# EAGLE design NSP2C (EAGLE 8.4.0)
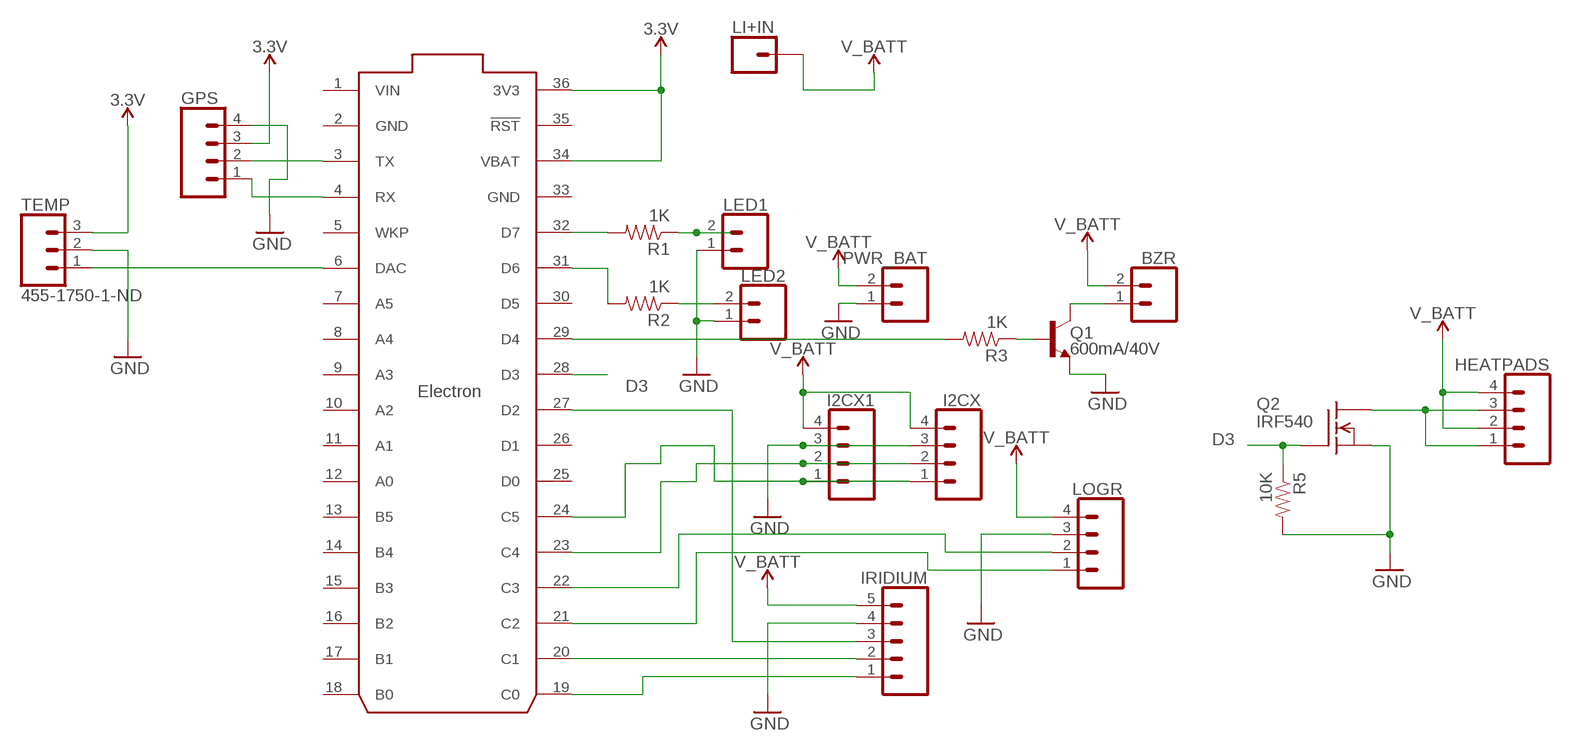
[diagram p0: schematic, sheet 1]

## Parts
BZR  CONN_02  [1X02]
GPS  CONN_04  [1X04]
HEATPADS  CONN_04  [1X04]
I2CX  CONN_04  [1X04]
I2CX1  CONN_04  [1X04]
IRIDIUM  CONN_05  [1X05]
LED1  CONN_02  [1X02]
LED2  CONN_02  [1X02]
LI+IN  CONN_01  [1X01]
LOGR  CONN_04  [1X04]
PWR_BAT  CONN_02  [1X02]
Q1  600mA/40V  TRANS_NPN-P2N2222A  [TO-92]
Q2  IRF540  [TO220]
R1  1K  RESISTORPTH-1/6W  [1/6W-RES]
R2  1K  RESISTORPTH-1/6W  [1/6W-RES]
R3  1K  RESISTORPTH-1/6W  [1/6W-RES]
R5  10K  RESISTORPTH-1/6W  [1/6W-RES]
TEMP  455-1750-1-ND  CONN_03  [1X03]
U$1  ELECTRON_WITH_HEADERS  [ELECTRON]

## Nets
3.3V: GPS.3 TEMP.3 U$1.34(VBAT) U$1.36(3V3)
BASE: Q1.2(B) R3.1
D3: Q2.1(G) R5.1 U$1.28(D3)
GND: GPS.4 I2CX1.3 I2CX.3 IRIDIUM.4 LED1.1 LED2.1 LOGR.3 PWR_BAT.1 Q1.3(E) Q2.3(S) R5.2 TEMP.2
IRWKP: IRIDIUM.3 U$1.27(D2)
N$1: TEMP.1 U$1.6(DAC)
N$3: R1.2 U$1.32(D7)
N$6: R3.2 U$1.29(D4)
N$8: LED1.2 R1.1
N$9: BZR.1 Q1.1(C)
N$11: HEATPADS.1 HEATPADS.3 Q2.2(D)
N$13: R2.2 U$1.31(D6)
N$14: IRIDIUM.2 U$1.20(C1)
N$15: I2CX1.1 I2CX.1 U$1.24(C5)
N$16: LED2.2 R2.1
RX: GPS.1 U$1.4(RX)
SDA: I2CX1.2 I2CX.2 U$1.23(C4)
TX: GPS.2 U$1.3(TX)
UART4_RX: LOGR.1 U$1.21(C2)
UART4_TX: LOGR.2 U$1.22(C3)
UART5_RX: IRIDIUM.1 U$1.19(C0)
V_BATT: BZR.2 HEATPADS.2 HEATPADS.4 I2CX1.4 I2CX.4 IRIDIUM.5 LI+IN.1 LOGR.4 PWR_BAT.2
Unconnected: U$1.5(WKP) U$1.7(A5) U$1.8(A4) U$1.9(A3) U$1.10(A2) U$1.11(A1) U$1.12(A0) U$1.13(B5) U$1.14(B4) U$1.15(B3) U$1.16(B2) U$1.17(B1) U$1.18(B0) U$1.25(D0) U$1.26(D1) U$1.30(D5) U$1.35(!RST)

## Power pins joined to a net without a drawn wire
GND: U$1.2(GND) U$1.33(GND)
VIN: U$1.1(VIN)

## Library data of the parts
BZR LED1 LED2 PWR_BAT = SparkFun-Connectors:CONN_02: Multi connection point. Often used as Generic Header-pin footprint for 0.1 inch spaced/style header connections On any of the 0.1 inch spaced packages, you can populate with these: Break Away Headers - Straight <https://www.sparkfun.com/products/116> (PRT-00116) Break Away Male Headers - Right Angle <https://www.sparkfun.com/products/553> (PRT-00553) Female Headers <https://www.sparkfun.com/products/115> (PRT-00115) Break Away Headers - Machine Pin <https://www.sparkfun.com/products/117> (PRT-00117) Break Away Female Headers - Swiss Machine Pin <https://www.sparkfun.com/products/743> (PRT-00743) For SCREWTERMINALS and SPRING TERMINALS visit here: Screw Terimnals on SparkFun.com <https://www.sparkfun.com/search/results?term=Screw+Terminals> (5mm/3.5mm/2.54mm spacing) This device is also useful as a general connection point to wire up your design to another part of your project. Our various solder wires solder well into these plated through hole pads. Hook-Up Wire - Assortment (Stranded, 22 AWG) <https://www.sparkfun.com/products/11375> (PRT-11375) Hook-Up Wire - Assortment (Solid Core, 22 AWG) <https://www.sparkfun.com/products/11367> (PRT-11367) View the entire wire category on our website here <https://www.sparkfun.com/categories/141> Special notes: Molex polarized connector foot print use with: PRT-08233 with associated crimp pins and housings. 2.54_SCREWTERM for use with PRT-10571. 3.5mm Screw Terminal footprints for PRT-08084 5mm Screw Terminal footprints for use with PRT-08432
GPS HEATPADS I2CX I2CX1 LOGR = SparkFun-Connectors:CONN_04: Multi connection point. Often used as Generic Header-pin footprint for 0.1 inch spaced/style header connections On any of the 0.1 inch spaced packages, you can populate with these: Break Away Headers - Straight <https://www.sparkfun.com/products/116> (PRT-00116) Break Away Male Headers - Right Angle <https://www.sparkfun.com/products/553> (PRT-00553) Female Headers <https://www.sparkfun.com/products/115> (PRT-00115) Break Away Headers - Machine Pin <https://www.sparkfun.com/products/117> (PRT-00117) Break Away Female Headers - Swiss Machine Pin <https://www.sparkfun.com/products/743> (PRT-00743) For SCREWTERMINALS and SPRING TERMINALS visit here: Screw Terimnals on SparkFun.com <https://www.sparkfun.com/search/results?term=Screw+Terminals> (5mm/3.5mm/2.54mm spacing) This device is also useful as a general connection point to wire up your design to another part of your project. Our various solder wires solder well into these plated through hole pads. Hook-Up Wire - Assortment (Stranded, 22 AWG) <https://www.sparkfun.com/products/11375> (PRT-11375) Hook-Up Wire - Assortment (Solid Core, 22 AWG) <https://www.sparkfun.com/products/11367> (PRT-11367) View the entire wire category on our website here <https://www.sparkfun.com/categories/141> Special notes: Molex polarized connector foot print use with SKU : PRT-08231 with associated crimp pins and housings. 1MM SMD Version SKU: PRT-10208; PROD_ID: CONN-09696
IRIDIUM = SparkFun-Connectors:CONN_05: Multi connection point. Often used as Generic Header-pin footprint for 0.1 inch spaced/style header connections On any of the 0.1 inch spaced packages, you can populate with these: Break Away Headers - Straight <https://www.sparkfun.com/products/116> (PRT-00116) Break Away Male Headers - Right Angle <https://www.sparkfun.com/products/553> (PRT-00553) Female Headers <https://www.sparkfun.com/products/115> (PRT-00115) Break Away Headers - Machine Pin <https://www.sparkfun.com/products/117> (PRT-00117) Break Away Female Headers - Swiss Machine Pin <https://www.sparkfun.com/products/743> (PRT-00743) For SCREWTERMINALS and SPRING TERMINALS visit here: Screw Terimnals on SparkFun.com <https://www.sparkfun.com/search/results?term=Screw+Terminals> (5mm/3.5mm/2.54mm spacing) This device is also useful as a general connection point to wire up your design to another part of your project. Our various solder wires solder well into these plated through hole pads. Hook-Up Wire - Assortment (Stranded, 22 AWG) <https://www.sparkfun.com/products/11375> (PRT-11375) Hook-Up Wire - Assortment (Solid Core, 22 AWG) <https://www.sparkfun.com/products/11367> (PRT-11367) View the entire wire category on our website here <https://www.sparkfun.com/categories/141> Special notes: Molex polarized connector foot print use with SKU : PRT-08231 with associated crimp pins and housings. 1MM SMD Version SKU: PRT-10208
LI+IN = SparkFun-Connectors:CONN_01: Single connection point. Often used as Generic Header-pin footprint for 0.1 inch spaced/style header connections On any of the 0.1 inch spaced packages, you can populate with these: Break Away Headers - Straight <https://www.sparkfun.com/products/116> (PRT-00116) Break Away Male Headers - Right Angle <https://www.sparkfun.com/products/553> (PRT-00553) Female Headers <https://www.sparkfun.com/products/115> (PRT-00115) Break Away Headers - Machine Pin <https://www.sparkfun.com/products/117> (PRT-00117) Break Away Female Headers - Swiss Machine Pin <https://www.sparkfun.com/products/743> (PRT-00743) This device is also useful as a general connection point to wire up your design to another part of your project. Our various solder wires solder well into these plated through hole pads. Hook-Up Wire - Assortment (Stranded, 22 AWG) <https://www.sparkfun.com/products/11375> (PRT-11375) Hook-Up Wire - Assortment (Solid Core, 22 AWG) <https://www.sparkfun.com/products/11367> (PRT-11367) View the entire wire category on our website here <https://www.sparkfun.com/categories/141> Special notes: SMTSO-256-ET is a "flush mount" nut for a 4-40 screw. We mostly use this on specialty testbeds; it is a nice way to connect hardware to your PCB at an adjustable hieght. Also note, the SNAP packages are for using a snappable style connector. We sell a baggie of snaps and they are also used on two LilyPad designs: Snap Assortment - 30 pack (male and female) <https://www.sparkfun.com/products/11347> (DEV-11347) LilyPad Arduino SimpleSnap <https://www.sparkfun.com/products/10941> (DEV-10941) LilyPad SimpleSnap Protoboard <https://www.sparkfun.com/products/10940> (DEV-10940)
Q1 = SparkFun-DiscreteSemi:TRANS_NPN: NPN transistor Current controlled devices typically used to amplify current or used as a switch. BC547 - COM-08928 <http://www.sparkfun.com/products/8928> (TO-92 45V 100mA) (1.Collector 2.Base 3.Emitter) 2N3904 - COM-00521 <http://www.sparkfun.com/products/521> (TO-92 40V 200mA) (1.Emitter 2.Base 3.Collector) P2N2222A - COM-12852 <http://www.sparkfun.com/products/12852> (TO-92 40V 600mA) (1.Collector 2.Base 3.Emitter); PROD_ID: TRANS-09536
Q2 = transistor-fet:IRF540: N-Channel Enhancement MOSFET (HEXFET); 100V; 28A; 0,077Ohm
R1-R3 R5 = SparkFun-Passives:RESISTOR: Resistor Basic schematic elements and footprints for 0603, 1206, and PTH resistors.
TEMP = SparkFun-Connectors:CONN_03: Multi connection point. Often used as Generic Header-pin footprint for 0.1 inch spaced/style header connections On any of the 0.1 inch spaced packages, you can populate with these: Break Away Headers - Straight <https://www.sparkfun.com/products/116> (PRT-00116) Break Away Male Headers - Right Angle <https://www.sparkfun.com/products/553> (PRT-00553) Female Headers <https://www.sparkfun.com/products/115> (PRT-00115) Break Away Headers - Machine Pin <https://www.sparkfun.com/products/117> (PRT-00117) Break Away Female Headers - Swiss Machine Pin <https://www.sparkfun.com/products/743> (PRT-00743) Stackable Header - 3 Pin (Female, 0.1") <https://www.sparkfun.com/products/13875> (PRT-13875) For SCREWTERMINALS and SPRING TERMINALS visit here: Screw Terimnals on SparkFun.com <https://www.sparkfun.com/search/results?term=Screw+Terminals> (5mm/3.5mm/2.54mm spacing) This device is also useful as a general connection point to wire up your design to another part of your project. Our various solder wires solder well into these plated through hole pads. Hook-Up Wire - Assortment (Stranded, 22 AWG) <https://www.sparkfun.com/products/11375> (PRT-11375) Hook-Up Wire - Assortment (Solid Core, 22 AWG) <https://www.sparkfun.com/products/11367> (PRT-11367) View the entire wire category on our website here <https://www.sparkfun.com/categories/141> Special notes: Molex polarized connector foot print use with SKU : PRT-08232 with associated crimp pins and housings.; PROD_ID: XXX-00000
U$1 = Particle-Devices:ELECTRON: Particle Electron footprint

## Board
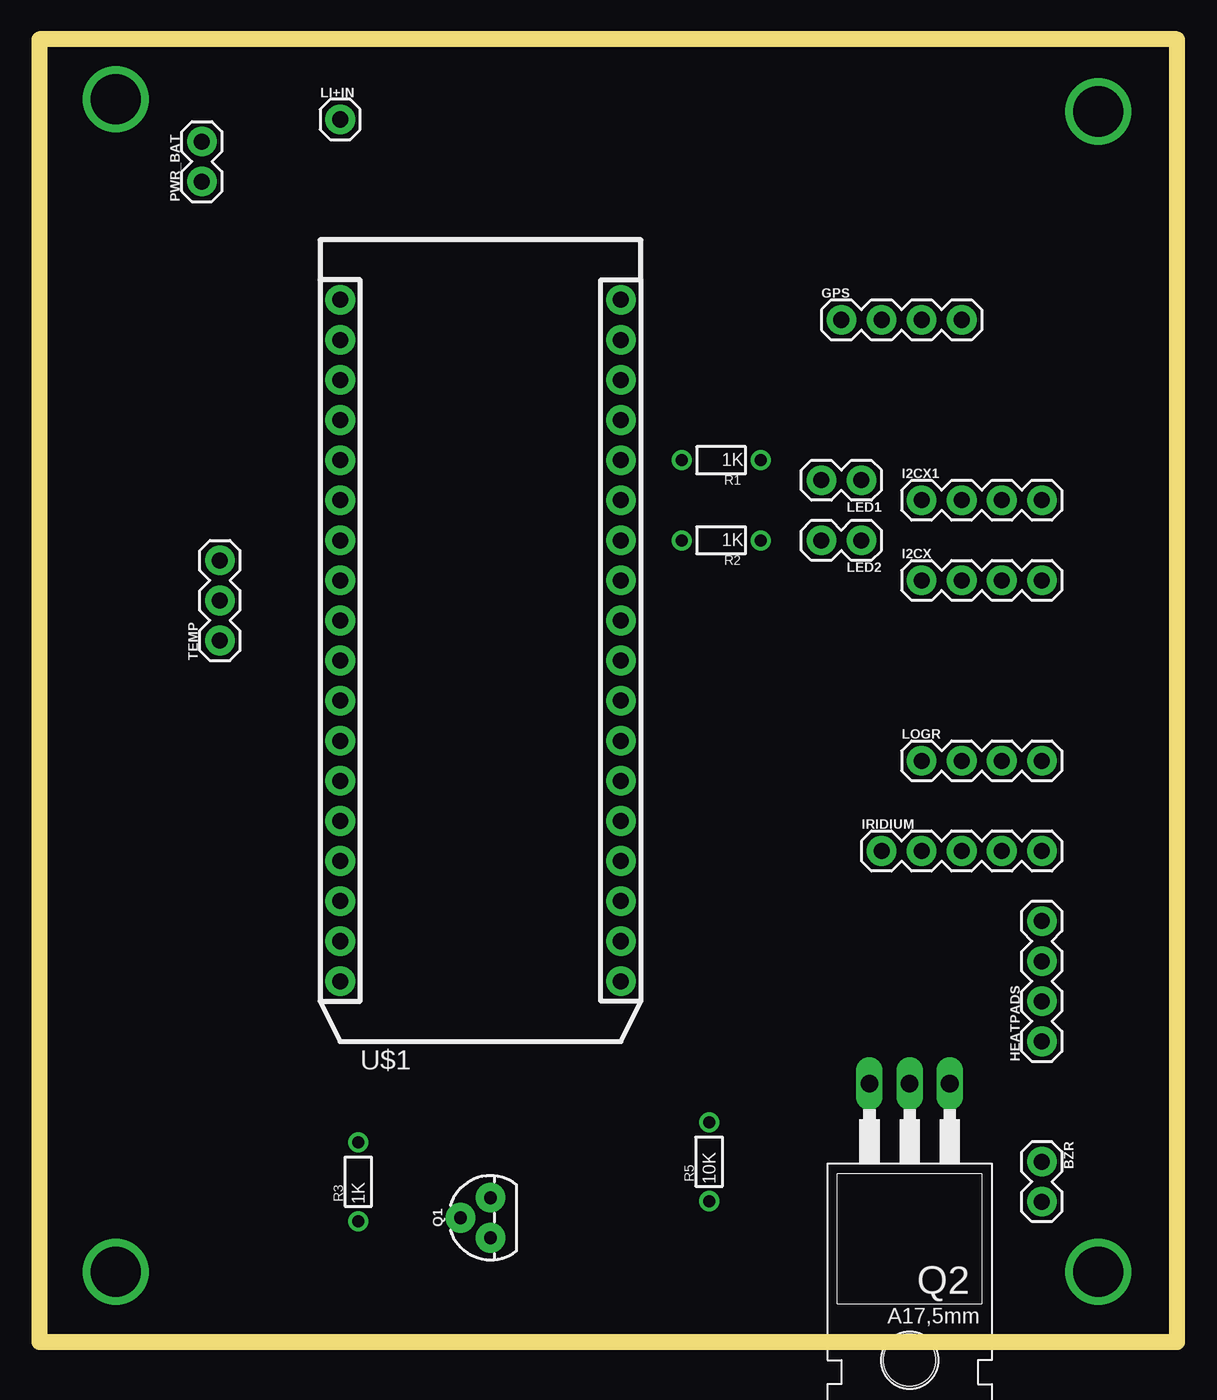
[diagram p1: board, top side]
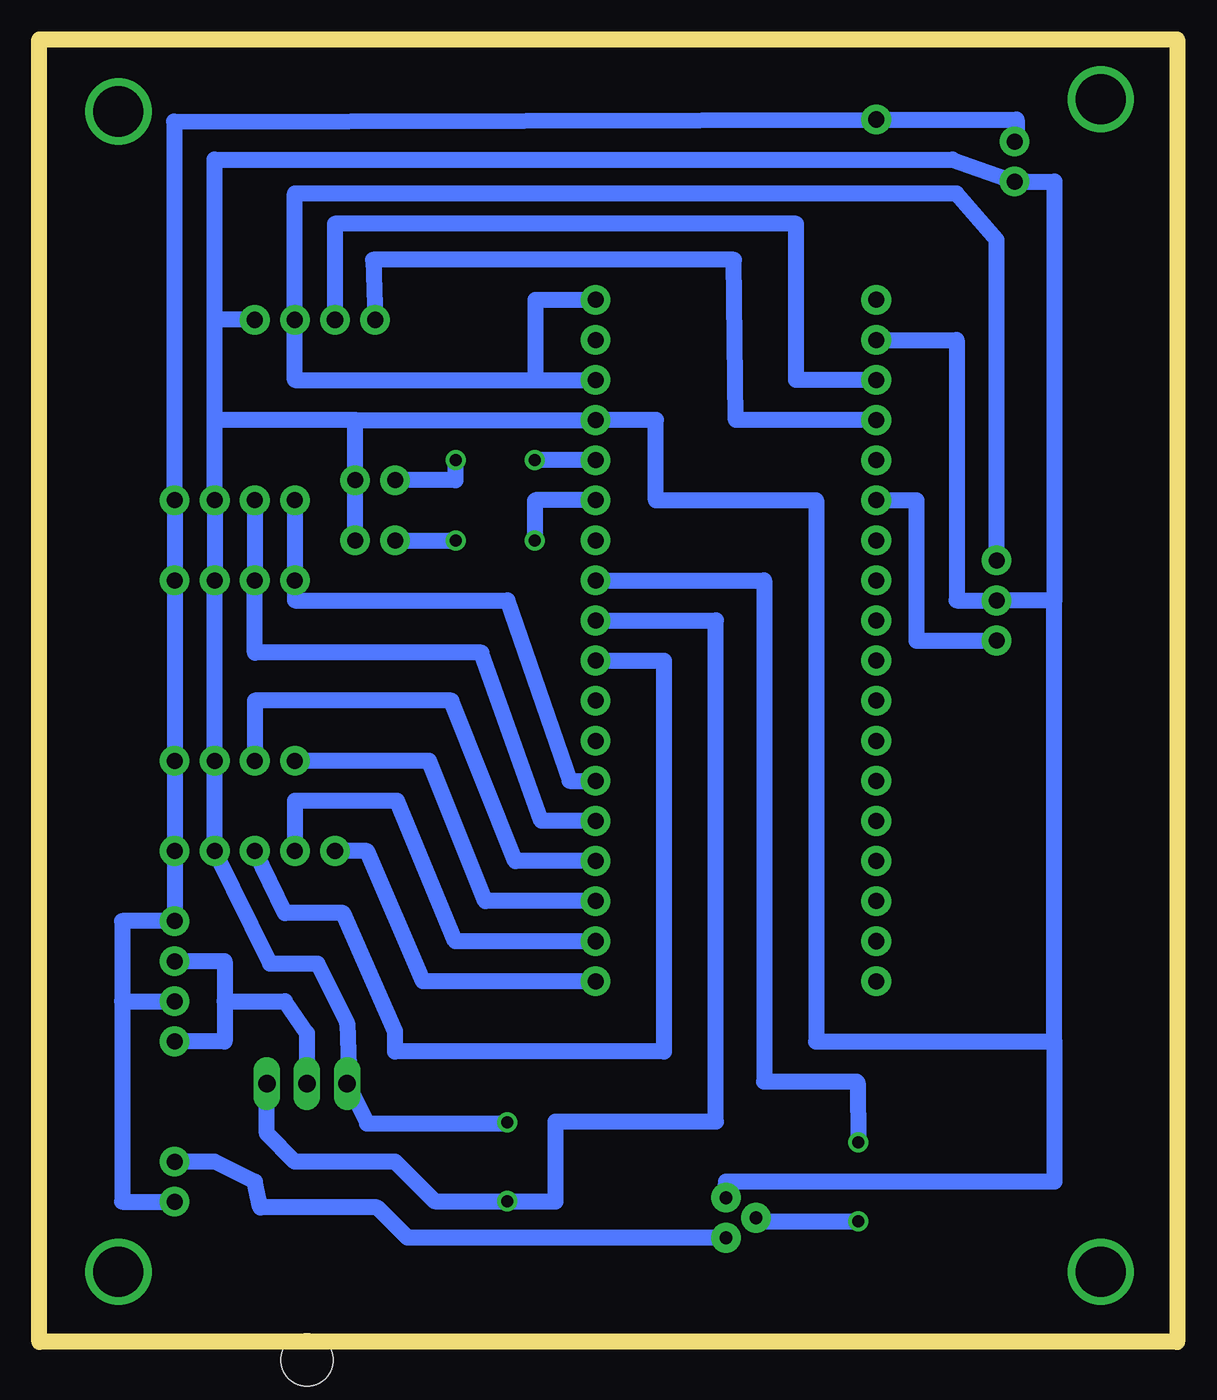
[diagram p2: board, bottom side, seen from below]

Size 72.06 x 82.54 mm. Coordinates in mm from the lower left corner, seen from the top.
Outline: 0,0 72.06,0 72.06,82.54 0,82.54 0,0
Copper layers (1*16): Top 0.035mm / dielectric 1.5mm / Bottom 0.035mm
Design rules "default": minimum track width 6mil, minimum drill 0.35mm, track to track 6mil, track to pad 6mil, pad to pad 6mil, via to via 6mil, smd to smd 6mil, copper to edge 40mil, drill to drill 6mil, minimum pad ring 10mil, minimum via ring 8mil, stop-mask expansion 4mil, vias tented up to drill 0mil, thermal gap 10mil

### Footprints (pad centres in the part's own frame; a part is rotated, then mirrored left to right if it is on the bottom)
1X02 = drill 1.016 pad 1.88: 1 0,0; 2 2.54,0
1X04 = drill 1.016 pad 1.88: 1 0,0; 2 2.54,0; 3 5.08,0; 4 7.62,0
1X05 = drill 1.016 pad 1.88: 1 0,0; 2 2.54,0; 3 5.08,0; 4 7.62,0; 5 10.16,0
1X01 = drill 1.016 pad 1.88: 1 0,0
TO-92 = drill 0.813 pad 1.88: 1 -1.27,0; 2 0,1.905; 3 1.27,0
TO220 = drill 1.118 long: 1 -2.54,-6.35; 2 0,-6.35; 3 2.54,-6.35 | hole 3.302: 0,11.176
1/6W-RES = drill 0.762: 1 -2.5,0; 2 2.5,0
1X03 = drill 1.016 pad 1.88: 1 0,0; 2 2.54,0; 3 5.08,0
ELECTRON = drill 1.016 pad 1.88: 1 1.27,46.99; 2 1.27,44.45; 3 1.27,41.91; 4 1.27,39.37; 5 1.27,36.83; 6 1.27,34.29; 7 1.27,31.75; 8 1.27,29.21; 9 1.27,26.67; 10 1.27,24.13; 11 1.27,21.59; 12 1.27,19.05; 13 1.27,16.51; 14 1.27,13.97; 15 1.27,11.43; 16 1.27,8.89; 17 1.27,6.35; 18 1.27,3.81; 19 19.05,3.81; 20 19.05,6.35; 21 19.05,8.89; 22 19.05,11.43; 23 19.05,13.97; 24 19.05,16.51; 25 19.05,19.05; 26 19.05,21.59; 27 19.05,24.13; 28 19.05,26.67; 29 19.05,29.21; 30 19.05,31.75; 31 19.05,34.29; 32 19.05,36.83; 33 19.05,39.37; 34 19.05,41.91; 35 19.05,44.45; 36 19.05,46.99

### Placement (x,y rotation side)
BZR  63.5,11.43 270 top
GPS  50.8,64.77 0 top
HEATPADS  63.5,19.05 90 top
I2CX  55.88,48.26 0 top
I2CX1  55.88,53.34 0 top
IRIDIUM  53.34,31.11 0 top
LED1  52.07,54.61 180 top
LED2  52.07,50.8 180 top
LI+IN  19.05,77.47 0 top
LOGR  55.88,36.83 0 top
PWR_BAT  10.29,73.53 90 top
Q1  28.57,7.87 90 top
Q2  55.12,10.03 180 top
R1  43.18,55.88 180 top
R2  43.18,50.8 180 top
R3  20.19,10.16 90 top
R5  42.42,11.43 90 top
TEMP  11.43,44.45 90 top
U$1  17.78,19.05 0 top

### Tracks (layer width: path | path; a pad name or v marks a point on that pad's centre or on a via)
3.3V
  Bottom 1: 40.64,60.96 40.64,66.04 U$1.36 | 40.64,60.96 55.88,60.96 GPS.3 55.88,72.77 13.97,72.77 11.43,69.85 TEMP.3 | 40.64,60.96 U$1.34
BASE
  Bottom 1: Q1.2 26.46,7.66 R3.1
D3
  Bottom 1: U$1.28 29.21,45.72 29.21,13.97 39.37,13.97 39.37,8.89 39.41,8.93 R5.1 47.03,8.93 49.53,11.43 55.88,11.43 57.66,13.21 Q2.1
GND
  Bottom 1: 28.57,10.03 Q1.3 28.57,10.16 7.77,10.16 7.77,19.05 | R5.2 42.51,13.84 51.31,13.84 Q2.3 52.45,16.51 52.58,20.19 54.46,23.98 57.45,23.98 IRIDIUM.4 LOGR.3 I2CX.3 I2CX1.3 60.96,58.42 | 7.77,46.99 TEMP.2 13.97,46.99 13.97,63.5 U$1.2 | 7.77,19.05 7.77,46.99 | 7.77,19.05 22.86,19.05 22.86,53.34 33.02,53.34 33.02,58.42 U$1.33 52.07,58.42 | 52.07,58.42 60.96,58.42 | 60.96,58.42 60.96,64.77 | GPS.4 60.96,64.77 | 60.96,64.77 60.96,74.93 14.22,74.93 PWR_BAT.1 7.77,73.53 7.77,46.99 | LED2.1 LED1.1 52.07,58.42
IRWKP
  Bottom 1: U$1.27 32.51,43.18 32.51,18.41 49.53,18.41 49.53,19.68 52.83,27.18 56.52,27.18 IRIDIUM.3
N$1
  Bottom 1: U$1.6 16.51,53.34 16.51,44.45 TEMP.1
N$3
  Bottom 1: U$1.32 R1.2
N$4  (via drill 3.17)
  other vias: 67.06,77.98
N$5  (via drill 3.17)
  other vias: 67.06,4.45
N$6
  Bottom 1: U$1.29 26.16,48.26 26.16,16.51 20.32,16.51 20.23,16.42 R3.2
N$7  (via drill 3.17)
  other vias: 4.83,4.45
N$8
  Bottom 1: R1.1 45.72,55.84 45.72,54.61 LED1.2
N$9
  Bottom 1: Q1.1 48.74,6.6 50.67,8.53 58.06,8.53 58.42,10.16 60.96,11.43 BZR.1
N$11
  Bottom 1: HEATPADS.3 60.33,24.13 60.33,21.59 | 60.33,21.59 60.33,19.05 HEATPADS.1 | Q2.2 55.24,16.51 55.12,16.64 55.12,19.56 56.52,21.59 60.33,21.59
N$13
  Bottom 1: U$1.31 40.64,53.34 40.68,53.3 R2.2
N$14
  Bottom 1: U$1.20 45.72,25.4 49.4,34.29 55.88,34.29 IRIDIUM.2
N$15
  Bottom 1: I2CX1.1 I2CX.1 55.88,46.99 42.42,46.99 38.48,35.56 U$1.24
N$16
  Bottom 1: LED2.2 R2.1
N$17  (via drill 3.17)
  other vias: 4.83,78.74
RX
  Bottom 1: U$1.4 27.94,58.42 28.07,68.58 50.93,68.58 GPS.1
SDA
  Bottom 1: I2CX1.2 I2CX.2 58.42,43.69 44.07,43.69 40.26,33.02 U$1.23
TX
  Bottom 1: U$1.3 24.13,60.96 24.13,70.87 53.34,70.87 GPS.2
UART4_RX
  Bottom 1: LOGR.1 47.37,36.83 43.81,27.94 U$1.21
UART4_TX
  Bottom 1: 37.08,30.73 U$1.22 41.91,30.48 45.97,40.64 58.42,40.64 LOGR.2
UART5_RX
  Bottom 1: U$1.19 47.75,22.86 51.31,31.11 IRIDIUM.1
V_BATT
  Bottom 1: 66.83,21.59 66.83,26.67 HEATPADS.4 IRIDIUM.5 LOGR.4 I2CX.4 I2CX1.4 63.53,53.21 63.53,77.34 LI+IN.1 10.16,77.47 10.16,76.2 PWR_BAT.2 | 66.83,21.59 HEATPADS.2 | 66.83,21.59 66.83,8.89 BZR.2